# Altium schematic sheet ReboostV2_USB.SchDoc: USB
size 420 x 297 mm; SheetNumber: 7
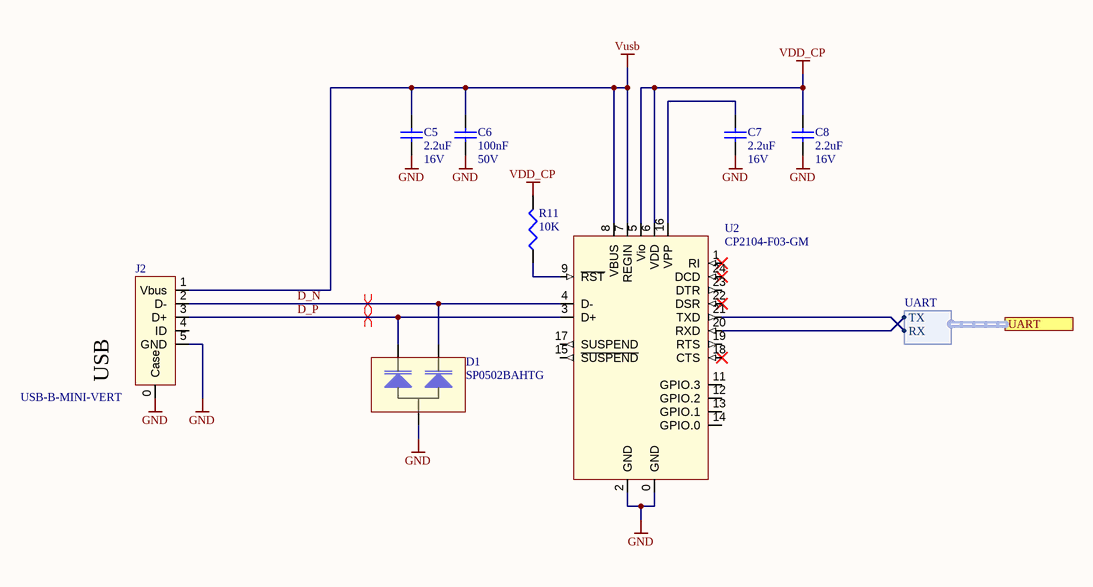
[diagram p0: ReboostV2_USB.SchDoc]

## Parts
C5  2.2uF  Voltage Rating: 16V  [C0603]
C6  100nF  Voltage Rating: 50V  [C0603]
C7  2.2uF  Voltage Rating: 16V  [C0603]
C8  2.2uF  Voltage Rating: 16V  [C0603]
D1  SP0502BAHTG  [SOT23]
J2  USB-B-MINI-VERT  [USB-B-MINI-VERT]
R11  10K  [0603]
U2  CP2104-F03-GM  [QFN24]

## Ports
UART (harness UART)

## Harnesses
UART: RX, TX

## Nets
GND: C5.1 C6.1 C7.1 C8.1 D1.A J2.0(Case) J2.5(GND) U2.0(GND) U2.2(GND)
VDD_CP: C8.2 R11.2 U2.5(Vio) U2.6(VDD)
Vusb: C5.2 C6.2 J2.1(Vbus) U2.7(REGIN) U2.8(VBUS)
D_N: D1.K1 J2.2(D-) U2.4(D-)
D_P: D1.K2 J2.3(D+) U2.3(D+)
NetC7_2: C7.2 U2.16(VPP)
NetR11_1: R11.1 U2.9(~{RST})
NetU2_20: U2.20(RXD) ; port UART.TX
NetU2_21: U2.21(TXD) ; port UART.RX

Not connected (* = marked no-connect by the designer): J2 4(ID); U2 1(RI)* 11(GPIO.3) 12(GPIO.2) 13(GPIO.1) 14(GPIO.0) 15(~{SUSPEND}) 17(SUSPEND) 18(CTS)* 19(RTS) 22(DSR)* 23(DTR) 24(DCD)*

## Layout directives
differential pair: D_N, D_P

## Notes on the sheet
- (near J2) USB
- PROJECT
- www.tpee.nl <http://www.tpee.nl>
- TITLE
- FILE NAME
- A3
- SIZE
- Author:
- SHEET
- OF

## Library data of the parts
C5 C7 C8 = 2.2uF/0603/CER/16V: Capacitor, 2.2uF, 16V, X5R; Capacitance Tolerance: +/- 10%; Capacitor Case Style: 0603; Brand Number: GRM188R61C225KE15D; Brand: MURATA; Dielectric Characteristic: X5R; Capacitance: 2.2uF; Temperature Range: -55°C to 85°C; Price: 0,077; Order Code Supplier: 1735526; Supplier: Farnell
C6 = 100nF/0603/CER/50V: Capacitor, 100nF, 50V, X7R; Capacitance Tolerance: ± 10%; Capacitor Case Style: 0603; Brand Number: MCCA000255; Brand: MULTICOMP; Dielectric Characteristic: X7R; Capacitance: 100nF; Temperature Range: -55°C to +125°C; Price: 0,008; Order Code Supplier: 1759122RL; Supplier: Farnell
D1 = SP0502BAHTG: Diode TVS Dual, Vrwm: 5.5V Vc: 8V; Brand: LITTLEFUSE; Case Style: SOT-23; Brand Number: SP0502BAHTG; Clamping Voltage: 8V; Order Code Supplier: 1827631; Price: 0,80; Supplier: Farnell; Temperature Range: -40°C to +125°C; Vrwm: 5.5V
J2 = WE-651005136421: Connector, Usb B Mini, Vertical, TH, WR-COM; Brand: WURTH ELEKTRONIK; Brand Number: 651005136421; Case Style: WR-COM; Order Code Supplier: 1841175; Pitch: *; Price: 3,37; Supplier: Farnell
R11 = 10K/0603/0063W/50V: Resistor, 10K, 1%, 0.063W, 50V, 100PPM, 0603; Brand: VISHAY DRALORIC; Brand Number: CRCW060310K0FKEA; Case Style: 0603; Order Code Supplier: 2122493; Power Rating: 0.063W; Price: 0,038; Resistance: 10K; Supplier: Farnell; Temperature Coefficient: ± 100PPM; Temperature Range: -55°C to +125°C; Voltage Rating: 50V
U2 = CP2104-F03-GM: USB to UART converter; Brand: Silicon Labs; Case Style: QFN24; Price: 1,65; Order Code Supplier: 757-4983; Brand Number: CP2104-F03-GM; Supplier: RS-Components